# Altium schematic sheet MCU.SchDoc
size A4; SheetNumber: 2; SheetTotal: 8
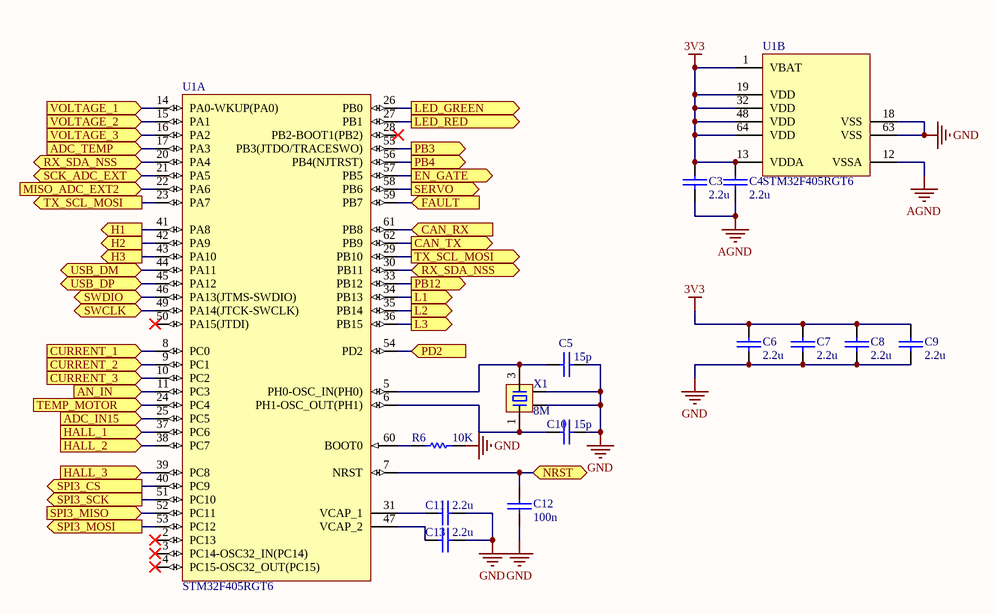
[diagram p0: MCU.SchDoc]

## Parts
C3  2.2u  [0603C]
C4  2.2u  [0603C]
C5  15p  [0603C]
C6  2.2u  [0603C]
C7  2.2u  [0603C]
C8  2.2u  [0603C]
C9  2.2u  [0603C]
C10  15p  [0603C]
C11  2.2u  [0603C]
C12  100n  [0603C]
C13  2.2u  [0603C]
R6  10K  [0603R]
U1  STM32F405RGT6  [STM-LQFP64_N]  (parts A,B of 2)
X1  8M  [OSC 5032-4P]

## Ports
ADC_IN15 (in), ADC_TEMP (in), AN_IN (in), CAN_RX (in), CAN_TX (out), CURRENT_1 (in), CURRENT_2 (in), CURRENT_3 (in), EN_GATE (out), FAULT (in), H1 (out), H2 (out), H3 (out), HALL_1 (in), HALL_2 (in), HALL_3 (in), L1 (out), L2 (out), L3 (out), LED_GREEN (out), LED_RED (out), MISO_ADC_EXT2 (in), NRST (bidir), PB3 (out), PB4 (out), PB12 (out), PD2 (in), RX_SDA_NSS (bidir), SCK_ADC_EXT (bidir), SERVO (out), SPI3_CS (out), SPI3_MISO (in), SPI3_MOSI (out), SPI3_SCK (out), SWCLK (bidir), SWDIO (bidir), TEMP_MOTOR (in), TX_SCL_MOSI (out), USB_DM (bidir), USB_DP (bidir), VOLTAGE_1 (in), VOLTAGE_2 (in), VOLTAGE_3 (in)

## Nets
3V3: C3.1 C4.1 C6.1 C7.1 C8.1 C9.1 U1.1(VBAT) U1.13(VDDA) U1.19(VDD) U1.32(VDD) U1.48(VDD) U1.64(VDD)
AGND: C3.2 C4.2 U1.12(VSSA)
GND: C5.1 C6.2 C7.2 C8.2 C9.2 C10.1 C11.1 C12.2 C13.1 R6.2 U1.18(VSS) U1.63(VSS) X1.2 X1.4
ADC_IN15: U1.25(PC5) ; port ADC_IN15
ADC_TEMP: U1.17(PA3) ; port ADC_TEMP
AN_IN: U1.11(PC3) ; port AN_IN
CAN_RX: U1.61(PB8) ; port CAN_RX
CAN_TX: U1.62(PB9) ; port CAN_TX
CURRENT_1: U1.8(PC0) ; port CURRENT_1
CURRENT_2: U1.9(PC1) ; port CURRENT_2
CURRENT_3: U1.10(PC2) ; port CURRENT_3
EN_GATE: U1.57(PB5) ; port EN_GATE
FAULT: U1.59(PB7) ; port FAULT
H1: U1.41(PA8) ; port H1
H2: U1.42(PA9) ; port H2
H3: U1.43(PA10) ; port H3
HALL_1: U1.37(PC6) ; port HALL_1
HALL_2: U1.38(PC7) ; port HALL_2
HALL_3: U1.39(PC8) ; port HALL_3
L1: U1.34(PB13) ; port L1
L2: U1.35(PB14) ; port L2
L3: U1.36(PB15) ; port L3
LED_GREEN: U1.26(PB0) ; port LED_GREEN
LED_RED: U1.27(PB1) ; port LED_RED
MISO_ADC_EXT2: U1.22(PA6) ; port MISO_ADC_EXT2
NRST: C12.1 U1.7(NRST) ; port NRST
PB3: U1.55(PB3(JTDO/TRACESWO)) ; port PB3
PB4: U1.56(PB4(NJTRST)) ; port PB4
PB12: U1.33(PB12) ; port PB12
PD2: U1.54(PD2) ; port PD2
RX_SDA_NSS: U1.20(PA4) U1.30(PB11) ; port RX_SDA_NSS
SCK_ADC_EXT: U1.21(PA5) ; port SCK_ADC_EXT
SERVO: U1.58(PB6) ; port SERVO
SPI3_CS: U1.40(PC9) ; port SPI3_CS
SPI3_MISO: U1.52(PC11) ; port SPI3_MISO
SPI3_MOSI: U1.53(PC12) ; port SPI3_MOSI
SPI3_SCK: U1.51(PC10) ; port SPI3_SCK
SWCLK: U1.49(PA14(JTCK-SWCLK)) ; port SWCLK
SWDIO: U1.46(PA13(JTMS-SWDIO)) ; port SWDIO
TEMP_MOTOR: U1.24(PC4) ; port TEMP_MOTOR
TX_SCL_MOSI: U1.23(PA7) U1.29(PB10) ; port TX_SCL_MOSI
USB_DM: U1.44(PA11) ; port USB_DM
USB_DP: U1.45(PA12) ; port USB_DP
VOLTAGE_1: U1.14(PA0-WKUP(PA0)) ; port VOLTAGE_1
VOLTAGE_2: U1.15(PA1) ; port VOLTAGE_2
VOLTAGE_3: U1.16(PA2) ; port VOLTAGE_3
NetC5_2: C5.2 U1.5(PH0-OSC_IN(PH0)) X1.3
NetC10_2: C10.2 U1.6(PH1-OSC_OUT(PH1)) X1.1
NetC11_2: C11.2 U1.31(VCAP_1)
NetC13_2: C13.2 U1.47(VCAP_2)
NetR6_1: R6.1 U1.60(BOOT0)

Not connected (* = marked no-connect by the designer): U1 2(PC13)* 3(PC14-OSC32_IN(PC14))* 4(PC15-OSC32_OUT(PC15))* 28(PB2-BOOT1(PB2))* 50(PA15(JTDI))*

## Library data of the parts
C3-C13 = CAP: 无极性电容
R6 = RES
U1 = CMP-0243-00019-3: ARM Cortex-M4 32-bit MCU+FPU, 210 DMIPS, 1024 kB Flash, 192 kB Internal RAM, 51 I/Os, 64-pin LQFP, -40 to 85 degC, Tray; Manufacturer: STMicroelectronics; Supply Voltage(Vcc) min (V): 1.8; Supply Voltage(Vcc) max (V): 3.6; Internal RAM Size (kB): 192; I/Os (High Current): 51; D/A Converter: 2x12-bit; FLASH Size (Prog) (kB): 1024; Operating Frequency(F) (Processor speed) (MHz): 168; ComponentLink2Description: Datasheet; PackageVersion: Rev. 4, 06/2013; DatasheetVersion: Rev. 4; Core: ARM Cortex-M4; ComponentLink2URL: http://www.st.com/st-web-ui/static/active/en/resource/technical/document/datasheet/DM00037051.pdf; PackageReference: LQFP64; Packing: Tray; ComponentLink1Description: Manufacturer URL; ComponentLink3URL: http://www.st.com/st-web-ui/static/active/en/resource/technical/document/datasheet/DM00037051.pdf; ComponentLink3Description: Package Specification; Mounting Technology: Surface Mount; ComponentLink1URL: http://www.st.com/web/en/home.html; PackageDescription: 64-Pin Low Profile Quad Flat Package, 10 x 10 mm Body, 0.5 mm Pitch; PartNumber: STM32F405RGT6
X1 = XTAL-4P: 4脚无源晶振